# EAGLE design 5137_Pins_Schematic (EAGLE 7.3.0)
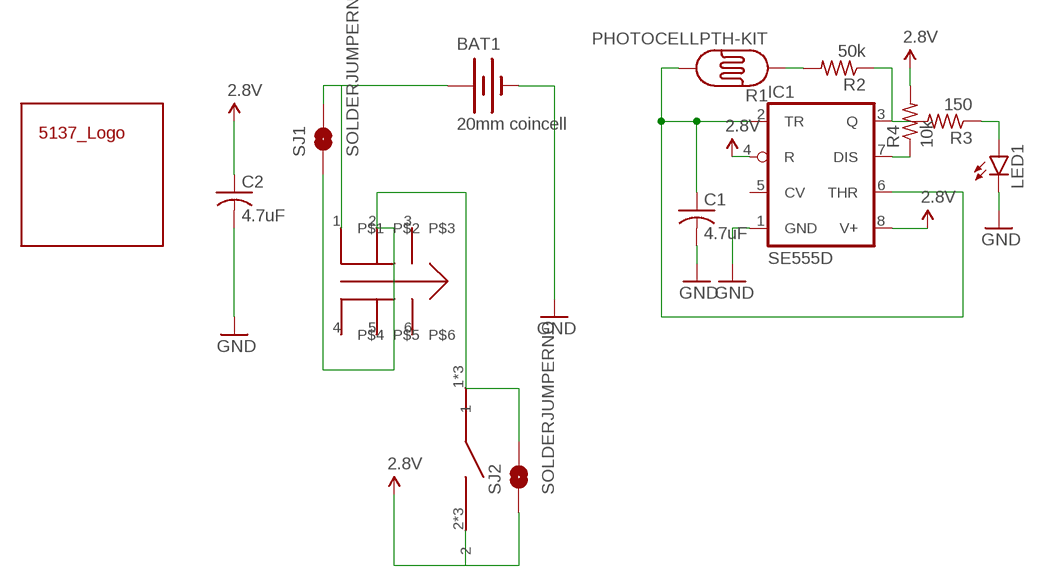
[diagram p0: schematic, sheet 1]

## Parts
BAT1  20mm coincell  BATTERY20MM_4LEGS  [BATTCON_20MM_4LEGS]
C1  4.7uF  C-USC1206K  [C1206K]
C2  4.7uF  C-USC1206K  [C1206K]
IC1  SE555D  [SO08]
LED1  LED5MM-KIT  [LED5MM-KIT]
R1  PHOTOCELLPTH-KIT  [PHOTOCELL-KIT]
R2  50k  R-US_R1206W  [R1206W]
R3  150  R-US_R1206W  [R1206W]
R4  10k  R-US_R1206W  [R1206W]
SJ1  SOLDERJUMPERNO  [SJ_2S-NO]
SJ2  SOLDERJUMPERNO  [SJ_2S-NO]
U$1  5137_LOGO_DEV  [5137_LOGO_PKG]
U$2  SAFETY_PIN_SWITCH  [SAFETY_PIN_SWITCH]
U$3  DPDT_GULL_WING_SWITCH  [DPDT_GULL_WING_SWITCH]

## Nets
2.8V: C2.1 IC1.4(R) IC1.8(V+) R4.2 SJ2.1 U$2.2 U$2.2A U$2.2B
GND: BAT1.2(-) C1.2 C2.2 IC1.1(GND) LED1.K(C)
N$1: IC1.3(Q) R2.1 R3.2
N$2: LED1.A R3.1
N$3: IC1.7(DIS) R4.1
N$4: R1.1 R2.2
N$5: C1.1 IC1.2(TR) IC1.6(THR) R1.2
N$6: BAT1.1(+) SJ1.2 U$3.1
N$7: SJ1.1 SJ2.2 U$2.1 U$2.1A U$2.1B U$3.2
Unconnected: IC1.5(CV) U$3.3 U$3.4 U$3.5 U$3.6

## Library data of the parts
BAT1 = SparkFun-Electromechanical:BATTERY: Battery Holders Various common sizes : AA, AAA, 18650 (PRT-12895), 20mm coin cell and 12mm coin cell. 20MM_4LEGS, BATT-10373; PROD_ID: BATT-10373
C1 C2 = adafruit:C-US: CAPACITOR, American symbol
IC1 = adafruit:*555: TIMER Changed DIP package to have round (not oval) pin pads http://www.ladyada.net/library/pcb/eaglelibrary.html
LED1 = SparkFun-LED:LED: LEDs Standard schematic elements and footprints for 5mm, 3mm, 1206, and 0603 sized LEDs. 5mm - Spark Fun Electronics SKU : COM-00529 (and others)
R1 = SparkFun-Sensors:PHOTOCELL: CdS photoresistor. This is a low cost way to detect light levels. Resistance decreases with more incoming light. SparkFun SKU: SEN-09088
R2-R4 = adafruit:R-US_: RESISTOR, American symbol
SJ1 SJ2 = SparkFun-Retired:SOLDERJUMPER: Solder Jumper Standard SMD solder jumper. Used to automate production. Two varients : Normally Open and Normally Closed are the same, but have different paste layers. NC will have a large amount of paste and should jumper during reflow.
U$1 = 5137_Logo:5137_LOGO_DEV
U$2 = Safety_Pin_Switch:SAFETY_PIN_SWITCH
U$3 = DPDT_GULL_WING_SWITCH:DPDT_GULL_WING_SWITCH

## Board
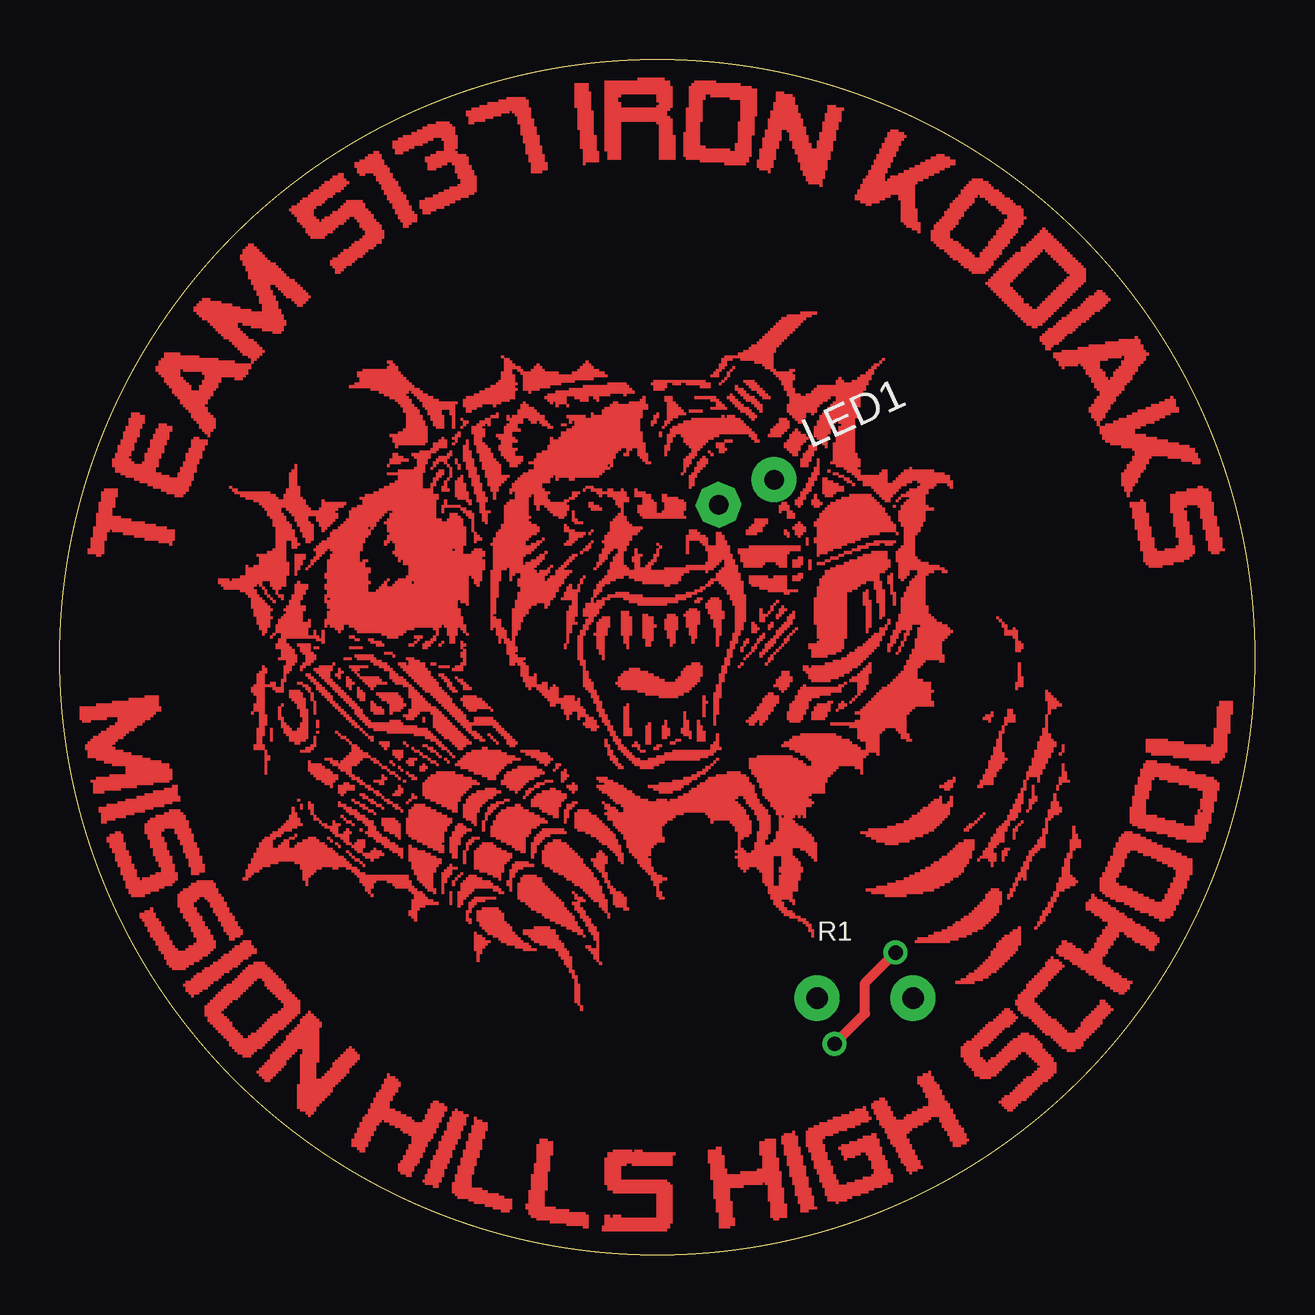
[diagram p1: board, top side]
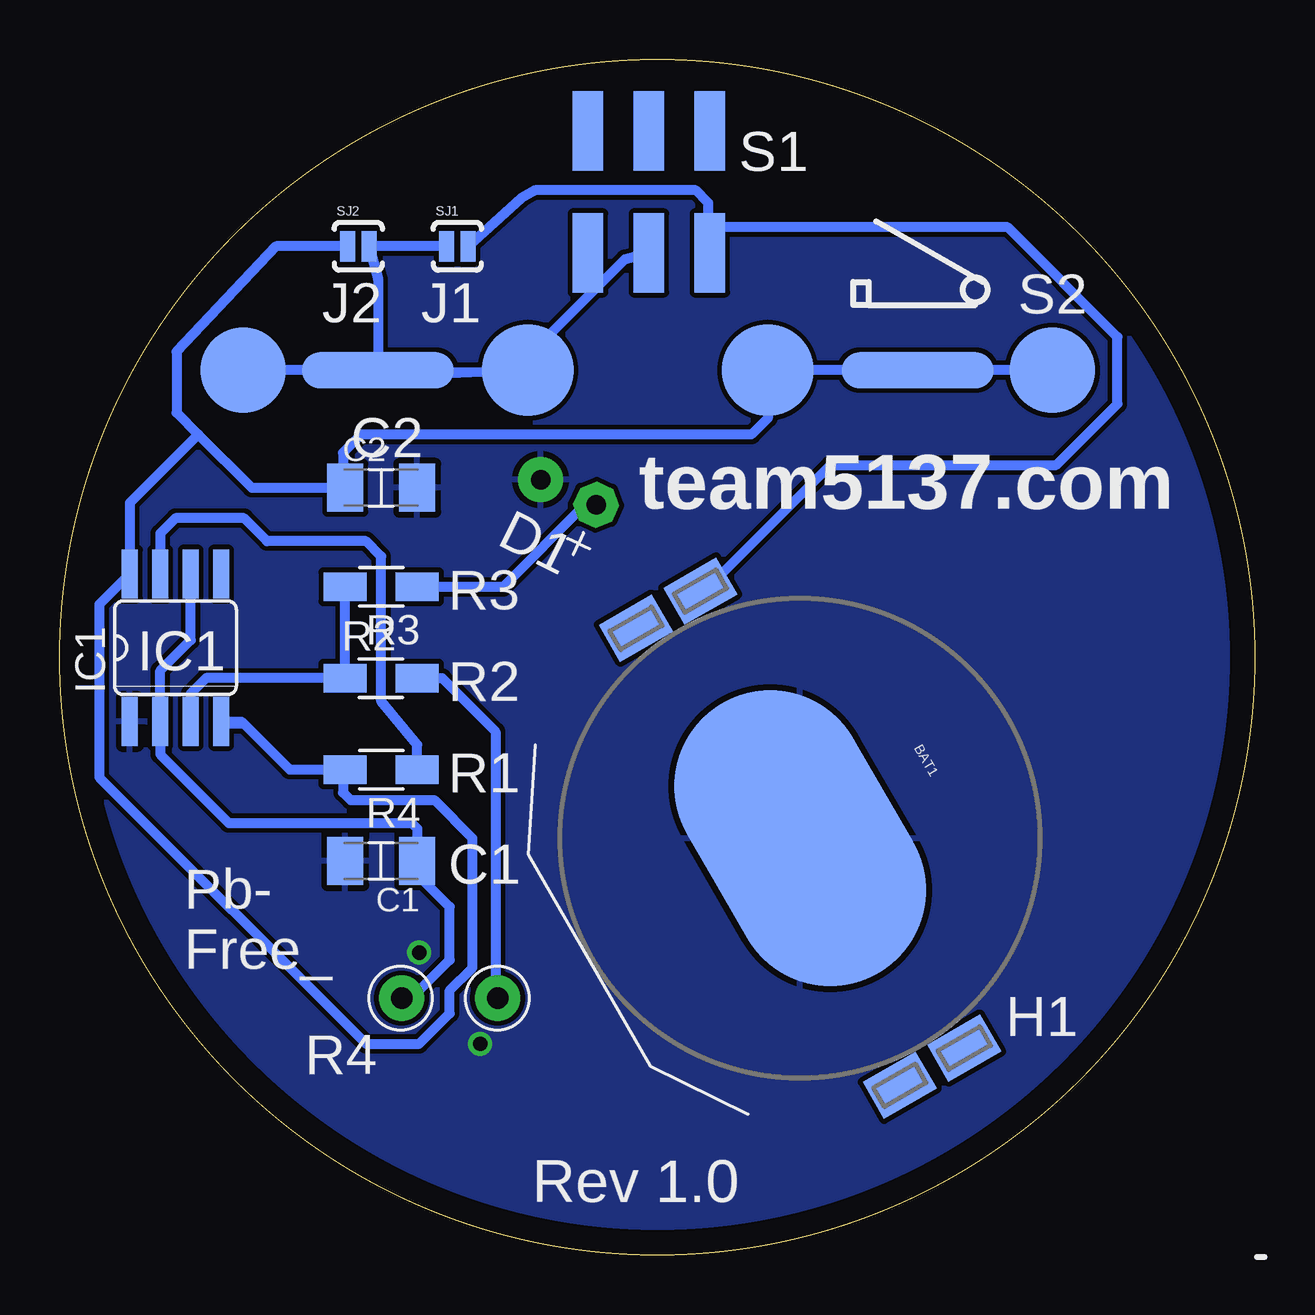
[diagram p2: board, bottom side, seen from below]

Size 49.8 x 49.8 mm. Coordinates in mm from the lower left corner, seen from the top.
Outline: circle at 24.9,24.9 radius 24.9
Copper layers (1*16): Top 0.035mm / dielectric 1.5mm / Bottom 0.035mm
Design rules "default": minimum track width 10mil, minimum drill 24mil, track to track 8mil, track to pad 8mil, pad to pad 8mil, via to via 8mil, smd to smd 8mil, copper to edge 40mil, drill to drill 8mil, minimum pad ring 10mil, minimum via ring 8mil, stop-mask expansion 4mil, vias tented up to drill 0mil, thermal gap 10mil

### Footprints (pad centres in the part's own frame; a part is rotated, then mirrored left to right if it is on the bottom)
BATTCON_20MM_4LEGS = smd 1.778 x 2.54: 1 -11,1.55; 3 11,1.55; P$1 -11,-1.55; P$2 11,-1.55 | smd 13 x 8: 2 0,0
C1206K = smd 1.5 x 2: 1 -1.5,0; 2 1.5,0
SO08 = smd 0.66 x 2.032: 1 -1.905,-3.073; 2 -0.635,-3.073; 3 0.635,-3.073; 4 1.905,-3.073; 5 1.905,3.073; 6 0.635,3.073; 7 -0.635,3.073; 8 -1.905,3.073
LED5MM-KIT = drill 0.813 pad 1.778 octagon: A -1.27,0 | drill 0.813 pad 1.88: K 1.27,0
PHOTOCELL-KIT = drill 0.9 pad 1.88: 1 -2,0; 2 2,0
R1206W = smd 1.8 x 1.2: 1 -1.499,0; 2 1.499,0
SJ_2S-NO = smd 0.635 x 1.27: 1 -0.45,0; 2 0.45,0
SAFETY_PIN_SWITCH = smd 6.35 x 1.5: 1 -11.25,0; 2 11.25,0 | smd 3.556 x 3.556: 1A -16.865,0; 2B 16.865,0 | smd 3.81 x 3.81: 1B -5,0; 2A 5,0
DPDT_GULL_WING_SWITCH = smd 1.27 x 3.302: 1 -2.54,2.54; 2 0,2.54; 3 2.54,2.54; 4 -2.54,-2.54; 5 0,-2.54; 6 2.54,-2.54

### Placement (x,y rotation side)
BAT1  18.95,17.36 300 bottom
C1  36.41,16.41 180 bottom
C2  36.41,31.97 0 bottom
IC1  44.98,25.3 0 bottom
LED1  28.61,31.79 24.4 top
R1  33.55,10.69 0 top
R2  36.41,24.03 0 bottom
R3  36.41,27.84 180 bottom
R4  36.41,20.22 180 bottom
SJ1  33.24,42.03 0 bottom
SJ2  37.37,42.03 0 bottom
U$1  24.8,24.16 0 top
U$2  25.3,36.87 0 bottom
U$3  25.25,44.3 180 bottom

### Tracks (layer width: path | path; a pad name or v marks a point on that pad's centre or on a via)
2.8V
  Bottom 0.406: 37.72,42.03 SJ2.1 40.79,42.03 44.94,37.63 44.94,35.09 44.03,34.19 | 44.03,34.19 41.81,31.97 C2.1 38,32.05 38,33.43 37.24,34.19 20.98,34.19 20.3,34.87 U$2.2A U$2.2 U$2.2B | 44.03,34.19 46.89,31.33 IC1.8 48.16,27.1 48.16,19.9 37.05,8.79 34.82,8.79 33.55,10.06 33.55,11.01 32.6,11.96 32.6,17.36 34.19,18.95 37.68,18.95 38,19.27 38,20.22 | R4.2 38,20.22 | 42.13,22.12 40.22,20.22 38,20.22 | 42.13,22.12 42.98,22.12 IC1.4 42.23,22.23 42.13,22.12
GND  (via drill 0.6)
  Top 0.406: v32.28,8.79 33.55,10.06 33.55,11.33 v34.82,12.6
  pour Bottom: 0.15,25.3 arc-90 25.3,50.45 25.81,50.45 arc-90 50.45,25.81 50.45,25.3 arc-90 25.3,0.15 24.79,0.15 arc-90 -0.1,25.05 -0.1,25.55 arc-90 0.15,25.81
N$1
  Bottom 0.406: R3.2 R2.1 43.71,24.03 44.35,23.39 IC1.3
N$2
  Bottom 0.406: LED1.A 27.95,31.22 31.33,27.84 R3.1
N$3
  Bottom 0.406: IC1.7 45.62,30.06 44.98,30.7 42.13,30.7 41.17,29.74 37.05,29.74 36.41,29.11 36.41,23.08 34.91,21.26 R4.1
N$4
  Bottom 0.406: R2.2 33.87,24.03 31.65,21.81 31.65,10.79 R1.1
N$5
  Bottom 0.406: R1.2 35.55,10.79 35.33,11.01 34.82,11.01 33.55,12.28 33.55,14.5 34.91,15.86 C1.1 34.91,17.77 35.14,18 42.76,18 45.62,20.85 IC1.2 45.62,24.35 44.35,25.62 IC1.6
N$6
  Bottom 0.406: SJ1.2 30.58,44.03 30,44.37 23.3,44.37 22.78,43.85 22.78,42.58 U$3.1 22.4,42.83 10.29,42.83 5.73,38.26 5.73,35.46 8.27,32.92 17.68,32.92 22.94,27.66 BAT1.1
N$7
  Bottom 0.406: 36.66,36.89 U$2.1 | U$3.2 26.25,41.49 29.74,38 U$2.1B 35.91,36.62 36.55,37.25 | SJ1.1 SJ2.2 36.55,40.67 36.55,37.25 | 36.55,37.25 U$2.1 | U$2.1 U$2.1A

### Text on the board
bPlace: S1 | S2 | J1 | J2 | C2 | team5137.com | D1 | R3 | IC1 | R2 | R1 | C1 | Pb- / Free_ | H1 | R4 | Rev 1.0